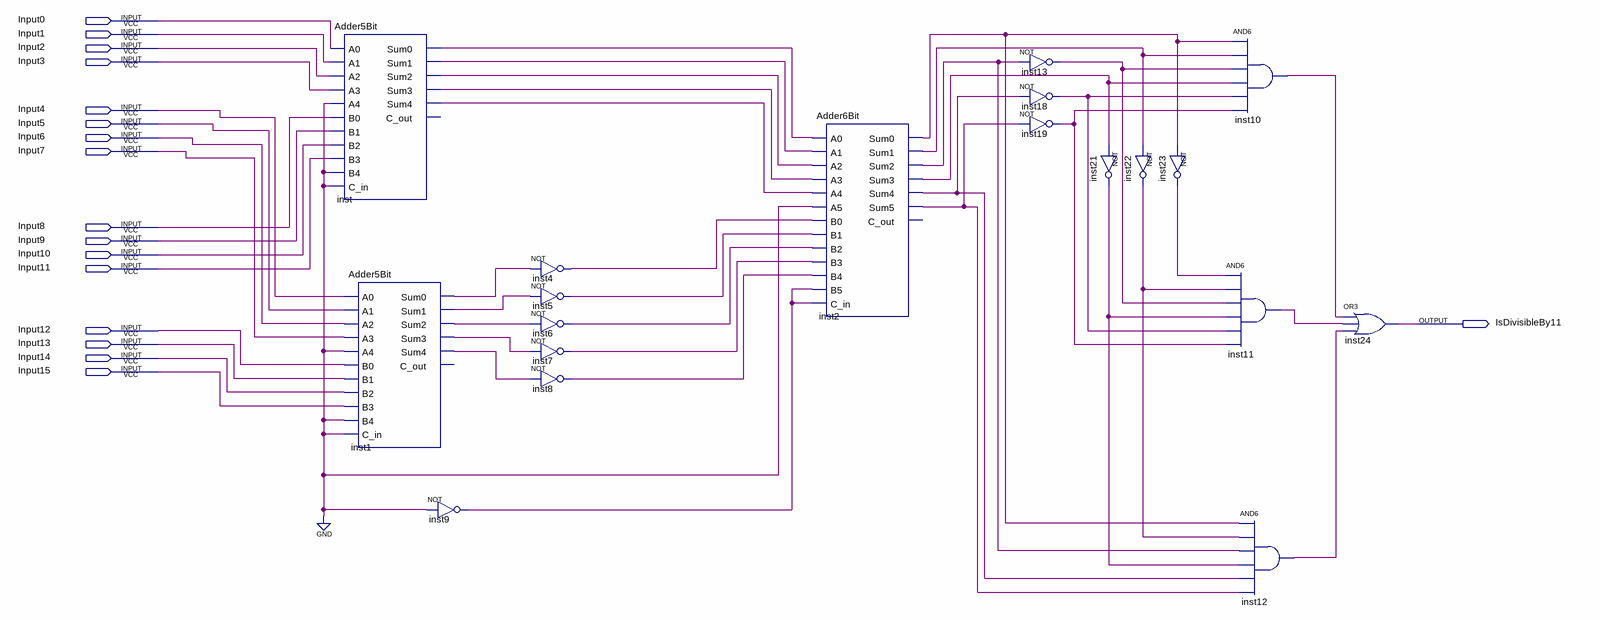
[diagram p0: schematic sheet]
// Quartus schematic DivisibilityBy11.bdf as structural Verilog: 19 symbols, 17 pins
module DivisibilityBy11 (
  input  Input0,
  input  Input1,
  input  Input2,
  input  Input3,
  input  Input4,
  input  Input5,
  input  Input6,
  input  Input7,
  input  Input8,
  input  Input9,
  input  Input10,
  input  Input11,
  input  Input12,
  input  Input13,
  input  Input14,
  input  Input15,
  output IsDivisibleBy11
);

  wire inst1_sum0, inst1_sum1, inst1_sum2, inst1_sum3, inst1_sum4, inst2_sum0, inst2_sum1, inst2_sum2,
       inst2_sum3, inst2_sum4, inst2_sum5, inst4_out, inst5_out, inst6_out, inst7_out, inst8_out, inst9_out,
       inst10_out, inst11_out, inst12_out, inst13_out, inst18_out, inst19_out, inst21_out, inst22_out,
       inst23_out, inst_sum0, inst_sum1, inst_sum2, inst_sum3, inst_sum4;

  Adder5Bit inst (
    .A0(Input0), .A1(Input1), .A2(Input2), .A3(Input3), .A4(1'b0), .B0(Input8), .B1(Input9), .B2(Input10),
    .B3(Input11), .B4(1'b0), .C_in(1'b0), .Sum0(inst_sum0), .Sum1(inst_sum1), .Sum2(inst_sum2),
    .Sum3(inst_sum3), .Sum4(inst_sum4));  // open: C_out
  Adder5Bit inst1 (
    .A0(Input4), .A1(Input5), .A2(Input6), .A3(Input7), .A4(1'b0), .B0(Input12), .B1(Input13), .B2(Input14),
    .B3(Input15), .B4(1'b0), .C_in(1'b0), .Sum0(inst1_sum0), .Sum1(inst1_sum1), .Sum2(inst1_sum2),
    .Sum3(inst1_sum3), .Sum4(inst1_sum4));  // open: C_out
  not inst9 (inst9_out, 1'b0);
  not inst4 (inst4_out, inst1_sum0);
  not inst5 (inst5_out, inst1_sum1);
  not inst6 (inst6_out, inst1_sum2);
  not inst7 (inst7_out, inst1_sum3);
  not inst8 (inst8_out, inst1_sum4);
  Adder6Bit inst2 (
    .A0(inst_sum0), .A1(inst_sum1), .A2(inst_sum2), .A3(inst_sum3), .A4(inst_sum4), .A5(1'b0),
    .B0(inst4_out), .B1(inst5_out), .B2(inst6_out), .B3(inst7_out), .B4(inst8_out), .B5(inst9_out),
    .C_in(inst9_out), .Sum0(inst2_sum0), .Sum1(inst2_sum1), .Sum2(inst2_sum2), .Sum3(inst2_sum3),
    .Sum4(inst2_sum4), .Sum5(inst2_sum5));  // open: C_out
  not inst13 (inst13_out, inst2_sum2);
  not inst18 (inst18_out, inst2_sum4);
  not inst19 (inst19_out, inst2_sum5);
  not inst21 (inst21_out, inst2_sum3);
  not inst22 (inst22_out, inst2_sum1);
  not inst23 (inst23_out, inst2_sum0);
  and inst10 (inst10_out, inst2_sum0, inst2_sum1, inst13_out, inst2_sum3, inst18_out, inst19_out);
  and inst11 (inst11_out, inst23_out, inst22_out, inst13_out, inst21_out, inst18_out, inst19_out);
  and inst12 (inst12_out, inst2_sum0, inst22_out, inst2_sum2, inst21_out, inst2_sum4, inst2_sum5);
  or inst24 (IsDivisibleBy11, inst10_out, inst11_out, inst12_out);
endmodule
